# Altium project 51min.PrjPcb
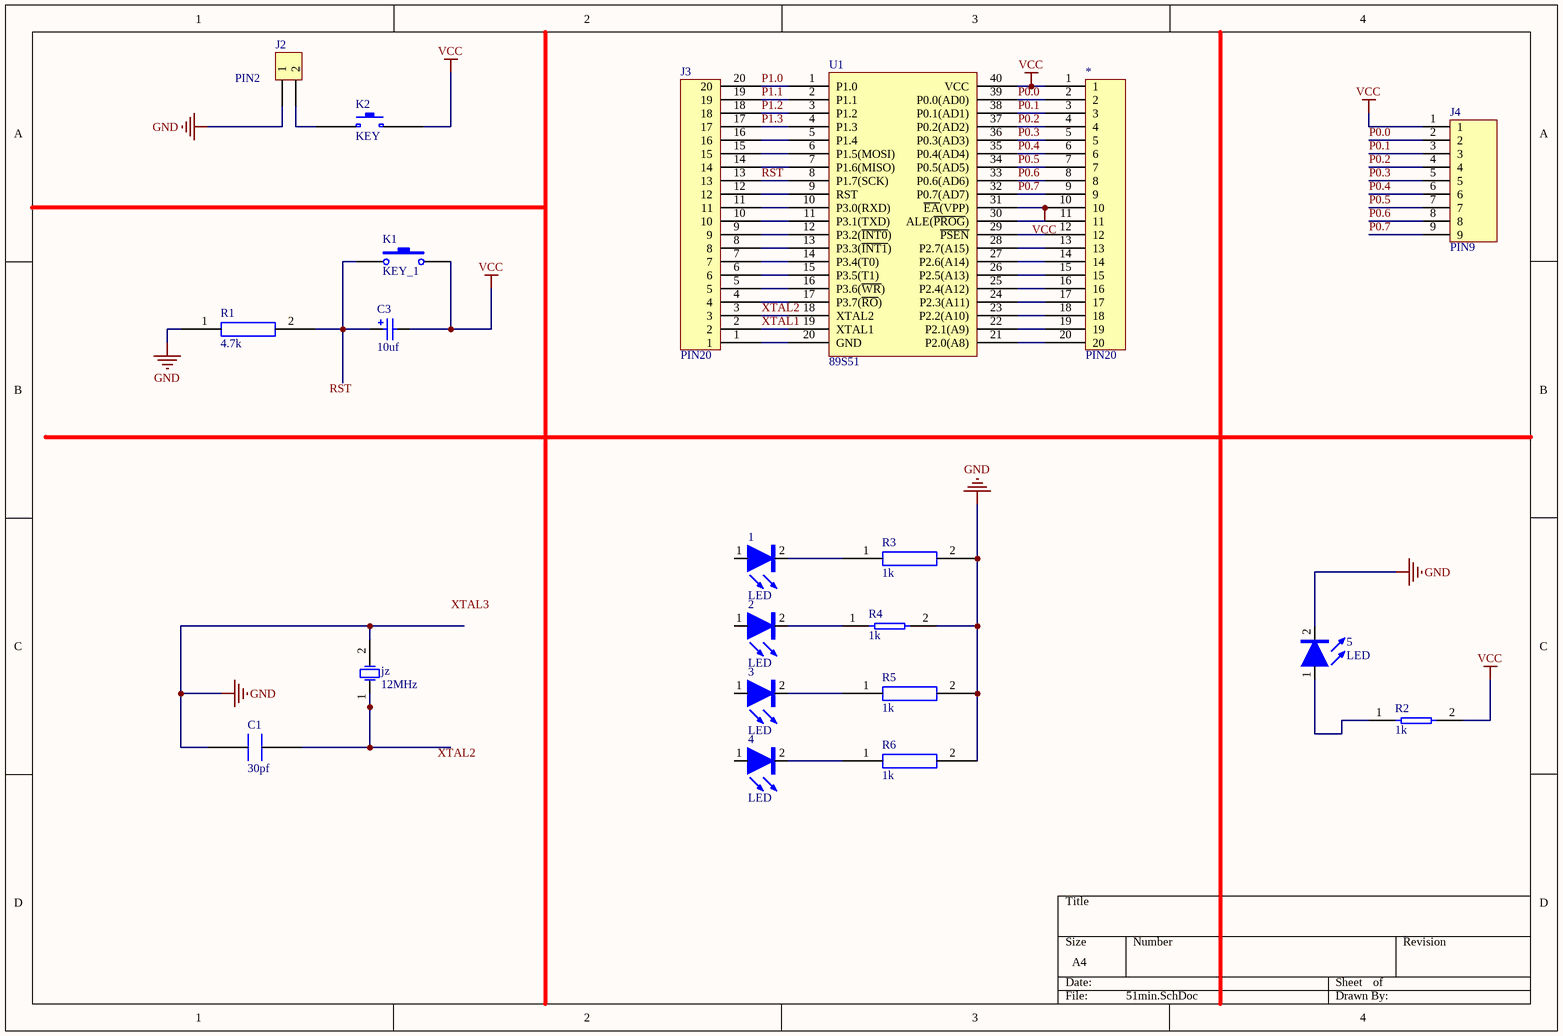
[diagram p0: 51min.SchDoc]
1 sheet, 21 parts. Net scope: global (net labels, ports and power ports of the same name join across sheets).
Board files: 最小51PCB.PcbDoc, 51min.PcbDoc

## Sheet 51min.SchDoc
size A4

### Parts
1  LED  [CAP]
2  LED  [CAP]
3  LED  [CAP]
4  LED  [CAP]
5  LED  [CAP]
*  PIN20  [PIN20]
C1  30pf  [CAP]
C3  10uf  [CAP]
J2  PIN2  [CAP]
J3  PIN20  [PIN20]
J4  PIN9  [PIN9]
jz  12MHz  [JINGZHEN]
K1  KEY_1  [KEY4]
K2  KEY  [KEY4]
R1  4.7k  [RES]
R2  1k  [RES]
R3  1k  [RES]
R4  1k  [RES]
R5  1k  [RES]
R6  1k  [RES]
U1  89S51  [DIP40]

### Nets
GND: 5.2 C1.?2 J2.?1(1) jz.2(OSC2) R1.1 R3.2 R4.2 R5.2 R6.2
VCC: *.1 *.10 C3.2 J4.1 K1.2 K2.?2 R2.2 U1.31(~{EA}(VPP)) U1.40(VCC)
P0.0: *.2 J4.2 U1.39(P0.0(AD0))
P0.1: *.3 J4.3 U1.38(P0.1(AD1))
P0.2: *.4 J4.4 U1.37(P0.2(AD2))
P0.3: *.5 J4.5 U1.36(P0.3(AD3))
P0.4: *.6 J4.6 U1.35(P0.4(AD4))
P0.5: *.7 J4.7 U1.34(P0.5(AD5))
P0.6: *.8 J4.8 U1.33(P0.6(AD6))
P0.7: *.9 J4.9 U1.32(P0.7(AD7))
P1.0: J3.20 U1.1(P1.0)
P1.1: J3.19 U1.2(P1.1)
P1.2: J3.18 U1.3(P1.2)
P1.3: J3.17 U1.4(P1.3)
RST: J3.13 U1.8(P1.7(SCK))
XTAL1: J3.2 U1.19(XTAL1)
XTAL2: J3.3 U1.18(XTAL2)
Net1_2: 1.2 R3.1
Net2_2: 2.2 R4.1
Net3_2: 3.2 R5.1
Net4_2: 4.2 R6.1
Net5_1: 5.1 R2.1
Net*_11: *.11 U1.30(ALE(~{PROG}))
Net*_12: *.12 U1.29(~{PSEN})
Net*_13: *.13 U1.28(P2.7(A15))
Net*_14: *.14 U1.27(P2.6(A14))
Net*_15: *.15 U1.26(P2.5(A13))
Net*_16: *.16 U1.25(P2.4(A12))
Net*_17: *.17 U1.24(P2.3(A11))
Net*_18: *.18 U1.23(P2.2(A10))
Net*_19: *.19 U1.22(P2.1(A9))
Net*_20: *.20 U1.21(P2.0(A8))
NetC1_?1: C1.?1 jz.1(OSC1)
NetC3_1: C3.1 K1.1 R1.2
NetJ2_?2: J2.?2(2) K2.?1
NetJ3_1: J3.1 U1.20(GND)
NetJ3_4: J3.4 U1.17(P3.7(~{RO}))
NetJ3_5: J3.5 U1.16(P3.6(~{WR}))
NetJ3_6: J3.6 U1.15(P3.5(T1))
NetJ3_7: J3.7 U1.14(P3.4(T0))
NetJ3_8: J3.8 U1.13(P3.3(~{INT1}))
NetJ3_9: J3.9 U1.12(P3.2(~{INT0}))
NetJ3_10: J3.10 U1.11(P3.1(TXD))
NetJ3_11: J3.11 U1.10(P3.0(RXD))
NetJ3_12: J3.12 U1.9(RST)
NetJ3_14: J3.14 U1.7(P1.6(MISO))
NetJ3_15: J3.15 U1.6(P1.5(MOSI))
NetJ3_16: J3.16 U1.5(P1.4)

Not connected (* = marked no-connect by the designer): 1 1; 2 1; 3 1; 4 1

### Notes on the sheet
- Labels drawn without touching a wire or pin: RST, XTAL2, XTAL3

### Library data of the parts
C1 = 电容
C3 = CAP_JIXING
jz = JINGZHEN
K2 = 按键开关
R1 R3 R5 R6 = 电阻
R2 R4 = R